# Altium schematic sheet RTC.SchDoc
size 420 x 297 mm; SheetNumber: 19; SheetTotal: 32
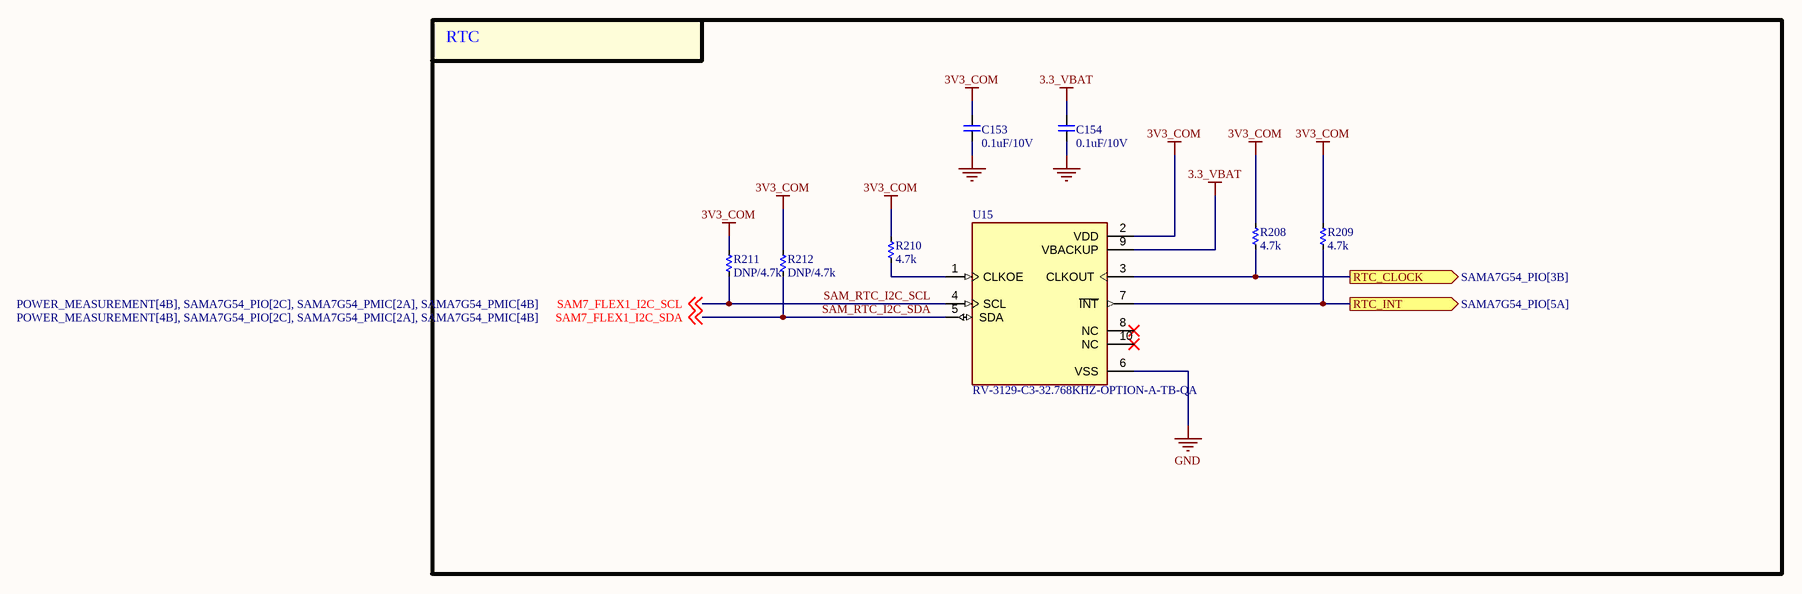
[diagram p0: RTC.SchDoc]

## Parts
C153  0.1uF/10V  [CAP_C_1005X50_L]
C154  0.1uF/10V  [CAP_C_1005X50_L]
R208  4.7k  [RES_C_1005x30_L]
R209  4.7k  [RES_C_1005x30_L]
R210  4.7k  [RES_C_1005x30_L]
R211  DNP/4.7k  [RES_C_1005x30_L]
R212  DNP/4.7k  [RES_C_1005x30_L]
U15  RV-3129-C3-32.768KHZ-OPTION-A-TB-QA  [IC_RV-3129-C3-32.768KHZ-OPTION-A-TB-QA]

## Blocks framed on the sheet
RTC: C153 C154 R208-R212 U15

## Ports
RTC_CLOCK (out, see SAMA7G54_PIO[3B]), RTC_INT (out, see SAMA7G54_PIO[5A])

## Nets
3.3_VBAT: C154.2 U15.9(VBACKUP)
3V3_COM: C153.2 R208.1 R209.1 R210.1 R211.1 R212.1 U15.2(VDD)
GND: C153.1 C154.1 U15.6(VSS)
RTC_CLOCK: R208.2 U15.3(CLKOUT) ; port RTC_CLOCK
RTC_INT: R209.2 U15.7(~{INT}) ; port RTC_INT
SAM_RTC_I2C_SCL: R211.2 U15.4(SCL) ; off-sheet SAM7_FLEX1_I2C_SCL  [also labelled SAM7_FLEX1_I2C_SCL]
SAM_RTC_I2C_SDA: R212.2 U15.5(SDA) ; off-sheet SAM7_FLEX1_I2C_SDA  [also labelled SAM7_FLEX1_I2C_SDA]
NetR210_2: R210.2 U15.1(CLKOE)

Not connected (* = marked no-connect by the designer): U15 8(NC)* 10(NC)*

## Notes on the sheet
- Project:
- Sub-system:
- Design by:
- Sheet title:
- Sheet
- A3
- of
- Checked by:
- Approved by:
- Revision:
- Document No:
- Size:
- Date:

## Library data of the parts
C153 C154 = _CAP_C_2: CAP
R208-R212 = _RES_B_2: RES
U15 = RV-3129-C3-32.768KHZ-OPTION-A-TB-QA: Real-Time Clock Module with I2C-Bus; MP: RV-3129-C3-32.768KHZ-OPTION-A-TB-QA; Value: *; Price: None; Package: None; Availability: Unavailable